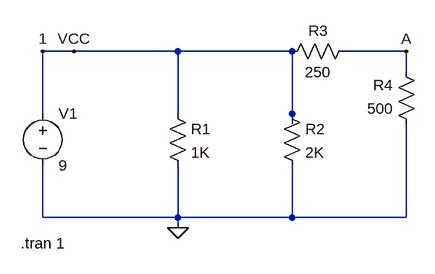
[diagram p0: schematic circuit.asc]
circuit.asc, the LTspice schematic file:
Version 4
SHEET 1 880 680
WIRE 176 32 128 32
WIRE 336 32 176 32
WIRE 512 32 336 32
WIRE 688 32 592 32
WIRE 688 64 688 32
WIRE 128 128 128 32
WIRE 336 128 336 32
WIRE 512 128 512 32
WIRE 512 144 512 128
WIRE 128 288 128 208
WIRE 336 288 336 208
WIRE 336 288 128 288
WIRE 512 288 512 208
WIRE 512 288 336 288
WIRE 688 288 688 144
WIRE 688 288 512 288
WIRE 336 304 336 288
FLAG 128 32 1
FLAG 336 304 0
FLAG 176 32 VCC
FLAG 688 32 A
SYMBOL voltage 128 112 R0
WINDOW 123 0 0 Left 0
WINDOW 39 0 0 Left 0
SYMATTR InstName V1
SYMATTR Value 9
SYMBOL res 320 112 R0
SYMATTR InstName R1
SYMATTR Value 1K
SYMBOL res 496 112 R0
SYMATTR InstName R2
SYMATTR Value 2K
SYMBOL res 608 16 R90
WINDOW 0 0 56 VBottom 2
WINDOW 3 32 56 VTop 2
SYMATTR InstName R3
SYMATTR Value 250
SYMBOL res 704 160 R180
WINDOW 0 36 76 Left 2
WINDOW 3 36 40 Left 2
SYMATTR InstName R4
SYMATTR Value 500
TEXT 94 328 Left 2 !.tran 1

The netlist it stands for:
* circuit.asc
V1 VCC 0 9
R1 VCC 0 1K
R2 VCC 0 2K
R3 A VCC 250
R4 0 A 500
.tran 1
.backanno
.end